# Altium project EDR.PrjPcb
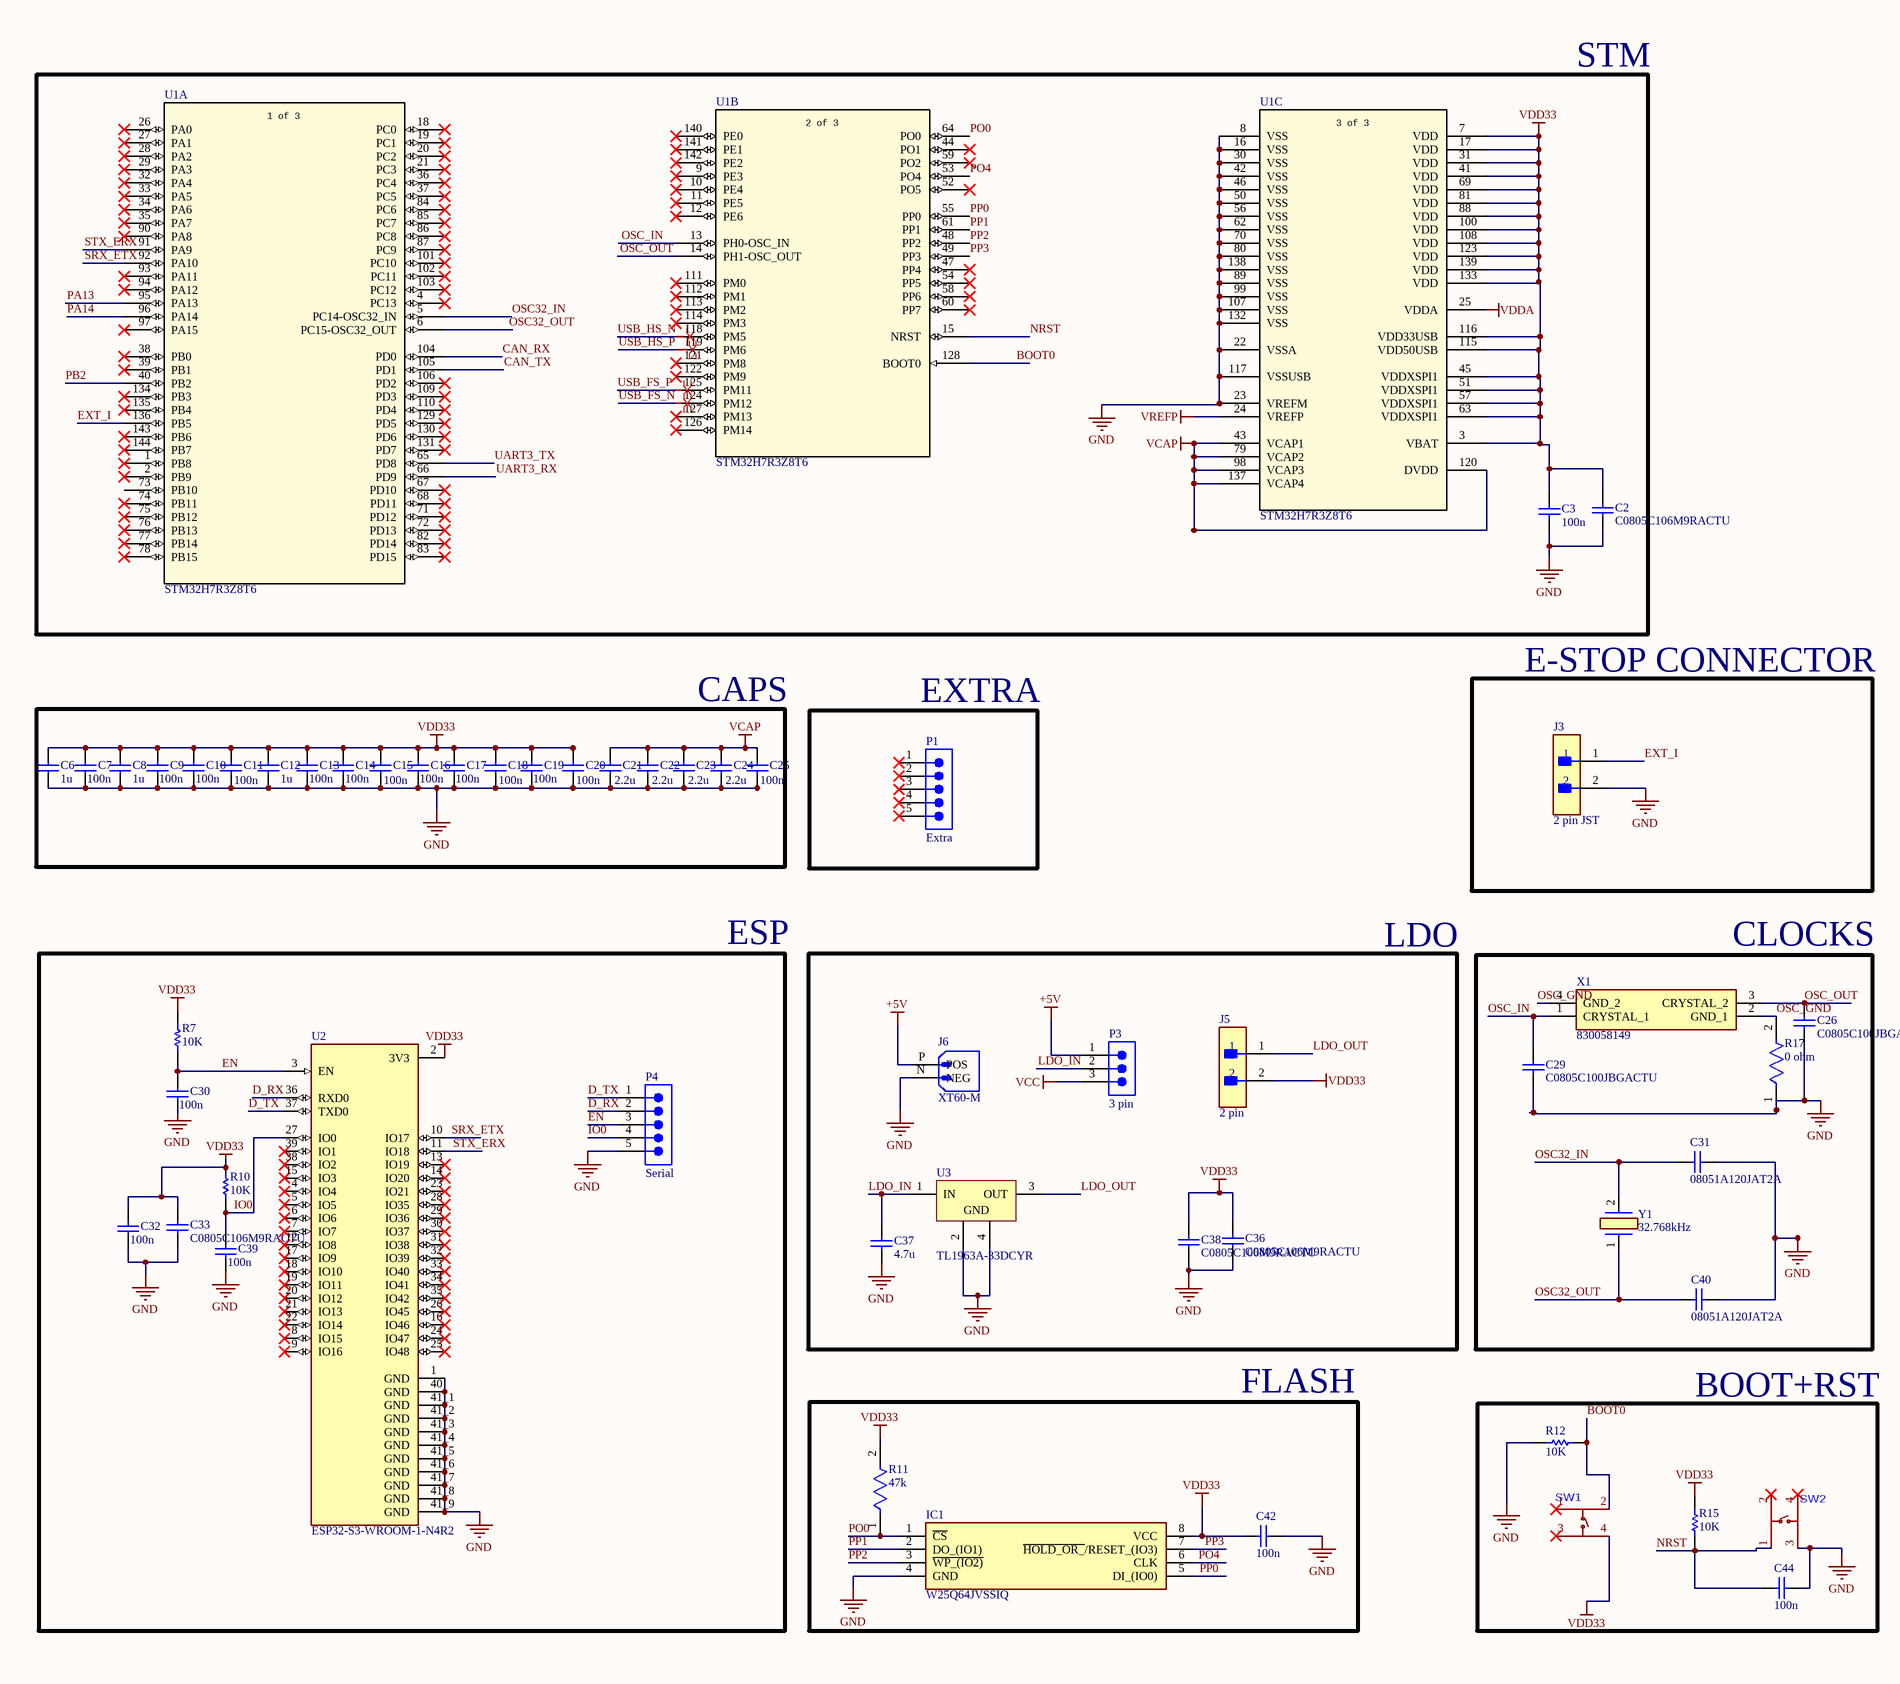
[diagram p0: EDR.SchDoc, left]
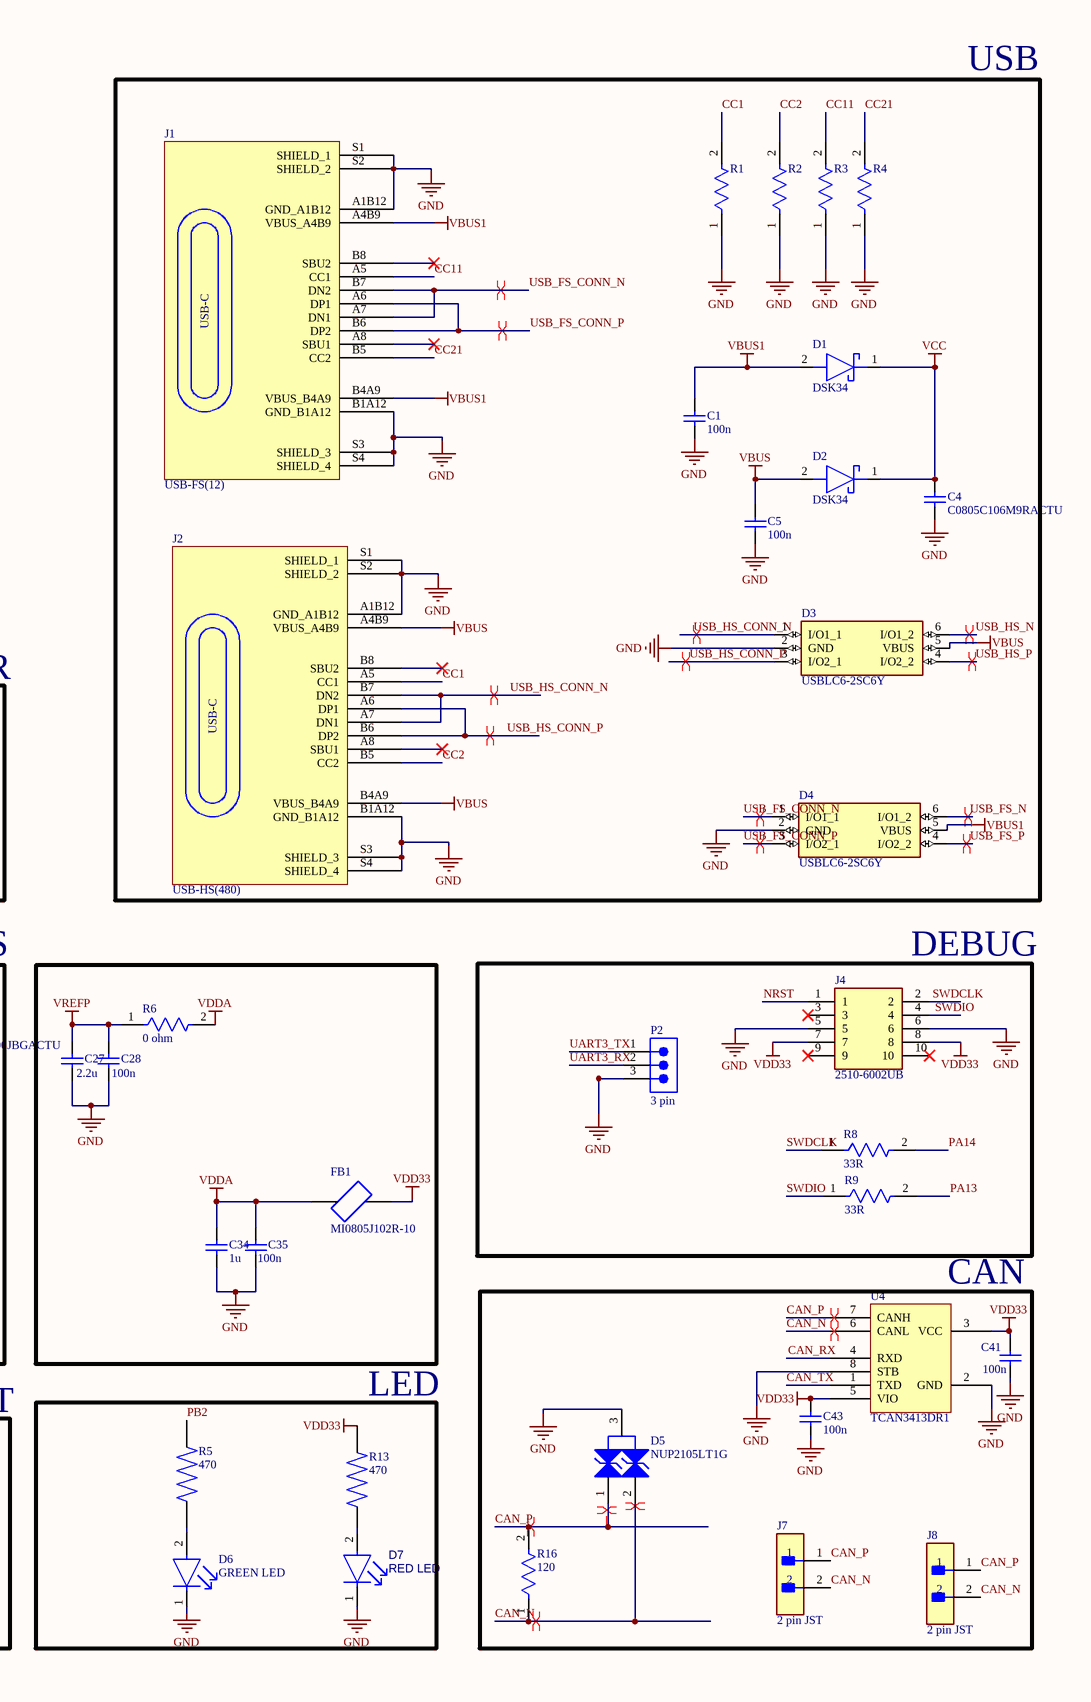
[diagram p1: EDR.SchDoc, right]
1 sheet, 89 parts. Net scope: global (net labels, ports and power ports of the same name join across sheets).
Board file: EDR.PcbDoc

## Sheet EDR.SchDoc: Main Controller
size A2; DrawnBy: Hasith Nettikumara, Chaleesha Keerawella; SheetNumber: 1; SheetTotal: 1

### Parts
C1  100n  [CAPC2013X145X48ML20T23]
C2  C0805C106M9RACTU  [CAPC2013X145X50ML20T25]
C3  100n  [CAPC2013X145X48ML20T23]
C4  C0805C106M9RACTU  [CAPC2013X145X50ML20T25]
C5  100n  [CAPC2013X145X48ML20T23]
C6  1u  [CAPC2013X145X50ML20T20]
C7  100n  [CAPC2013X145X48ML20T23]
C8  1u  [CAPC2013X145X50ML20T20]
C9  100n  [CAPC2013X145X48ML20T23]
C10  100n  [CAPC2013X145X48ML20T23]
C11  100n  [CAPC2013X145X48ML20T23]
C12  1u  [CAPC2013X145X50ML20T20]
C13  100n  [CAPC2013X145X48ML20T23]
C14  100n  [CAPC2013X145X48ML20T23]
C15  100n  [CAPC2013X145X48ML20T23]
C16  100n  [CAPC2013X145X48ML20T23]
C17  100n  [CAPC2013X145X48ML20T23]
C18  100n  [CAPC2013X145X48ML20T23]
C19  100n  [CAPC2013X145X48ML20T23]
C20  100n  [CAPC2013X145X48ML20T23]
C21  2.2u  [CAPC2013X140X50ML20T25]
C22  2.2u  [CAPC2013X140X50ML20T25]
C23  2.2u  [CAPC2013X140X50ML20T25]
C24  2.2u  [CAPC2013X140X50ML20T25]
C25  100n  [CAPC2013X145X48ML20T23]
C26  C0805C100JBGACTU  [CAPC1608X92X38NL15T08]
C27  2.2u  [CAPC2013X140X50ML20T25]
C28  100n  [CAPC2013X145X48ML20T23]
C29  C0805C100JBGACTU  [CAPC1608X92X38NL15T08]
C30  100n  [CAPC2013X145X48ML20T23]
C31  08051A120JAT2A  [CAPC1608X92X38NL15T08]
C32  100n  [CAPC2013X145X48ML20T23]
C33  C0805C106M9RACTU  [CAPC2013X145X50ML20T25]
C34  1u  [CAPC2013X145X50ML20T20]
C35  100n  [CAPC2013X145X48ML20T23]
C36  C0805C106M9RACTU  [CAPC2013X145X50ML20T25]
C37  4.7u  [CAPC2013X145X50ML20T25]
C38  C0805C106M9RACTU  [CAPC2013X145X50ML20T25]
C39  100n  [CAPC2013X145X48ML20T23]
C40  08051A120JAT2A  [CAPC1608X92X38NL15T08]
C41  100n  [CAPC2013X145X48ML20T23]
C42  100n  [CAPC2013X145X48ML20T23]
C43  100n  [CAPC2013X145X48ML20T23]
C44  100n  [CAPC2013X145X48ML20T23]
D1  DSK34  [SODFL3818X130N]
D2  DSK34  [SODFL3818X130N]
D3  USBLC6-2SC6Y  [SOT95P280X145-6N]
D4  USBLC6-2SC6Y  [SOT95P280X145-6N]
D5  NUP2105LT1G  [ONSC-SOT-23-3-318-08_V]
D6  GREEN LED  [FP-SML-210-MFG]
D7  RED LED  [LED_APHCM2012SURCK-F01]
FB1  MI0805J102R-10  [FB_MI0805J102R-10]
IC1  W25Q64JVSSIQ  [SOIC127P790X216-8N]
J1  USB-FS(12)  [FP-2171790001-MFG]
J2  USB-HS(480)  [FP-2171790001-MFG]
J3  2 pin JST  [FP-B2B-XH-A_LF_SN-MFG]
J4  2510-6002UB  [SHDR10W64P254_2X5_2002X859X991P]
J5  2 pin  [FP-TSW-102-07-F-S-MFG]
J6  XT60-M  [AMASS_XT60-M]
J7  2 pin JST  [FP-B2B-XH-A_LF_SN-MFG]
J8  2 pin JST  [FP-B2B-XH-A_LF_SN-MFG]
P1  Extra  [61300511121]
P2  3 pin  [61300311121]
P3  3 pin  [61300311121]
P4  Serial  [61300511121]
R1  (no value)  [FP-AC0805-IPC_B]
R2  (no value)  [FP-AC0805-IPC_B]
R3  (no value)  [FP-AC0805-IPC_B]
R4  (no value)  [FP-AC0805-IPC_B]
R5  470  [RESC2012X65N]
R6  0 ohm  [FP-HCJ0805-IPC_B]
R7  10K  [RESC0805(2012)_M]
R8  33R  [FP-AC0805-IPC_B]
R9  33R  [FP-AC0805-IPC_B]
R10  10K  [RESC0805(2012)_M]
R11  47k  [FP-CRCW0805-e3-IPC_B]
R12  10K  [RESC0805(2012)_M]
R13  470  [RESC2012X65N]
R15  10K  [RESC0805(2012)_M]
R16  120  [FP-RMCF0805-IPC_B]
R17  0 ohm  [FP-HCJ0805-IPC_B]
SW1  4.5X4.5X5.0WATERPROOF TACT SWITCH DIP 260G  [SW-TH_4P-L4.5-W4.5-P3.00-LS5.5 - duplicate]  (value not drawn)
SW2  4.5X4.5X5.0WATERPROOF TACT SWITCH DIP 260G  [SW-TH_4P-L4.5-W4.5-P3.00-LS5.5 - duplicate]  (value not drawn)
U1  STM32H7R3Z8T6  [LQFP-144_STM-M]  (parts A,B,C of 3)
U2  ESP32-S3-WROOM-1-N4R2  [XCVR_ESP32-S3-WROOM-1-N4R2]
U3  TL1963A-33DCYR  [DCY0004A_L]
U4  TCAN3413DR1  [TCAN3413DR1]
X1  830058149  [830058149-x1]
Y1  32.768kHz  [CM7V32768TBQA020]

### Blocks framed on the sheet
STM: C2 C3 U1
USB: C1 C4 C5 D1-D4 J1 J2 R1-R4
CAPS: C6-C25
EXTRA: P1
E-STOP CONNECTOR: J3
ESP: C30 C32 C33 C39 P4 R7 R10 U2
LDO: C36-C38 J5 J6 P3 U3
CLOCKS: C26 C29 C31 C40 R17 X1 Y1
DEBUG: J4 P2 R8 R9
CAN: C41 C43 D5 J7 J8 R16 U4
FLASH: C42 IC1 R11
BOOT+RST: C44 R12 R15 SW1 SW2
LED: D6 D7 R5 R13

### Nets
+5V: J6.P(POS) P3.1
GND: C1.1 C2.1 C3.1 C4.1 C5.1 C6.1 C7.1 C8.1 C9.1 C10.1 C11.1 C12.1 C13.1 C14.1 C15.1 C16.1 C17.1 C18.1 C19.1 C20.1 C21.1 C22.1 C23.1 C24.1 C25.1 C26.2 C27.1 C28.1 C29.1 C30.1 C31.2 C32.1 C33.1 C34.1 C35.1 C36.1 C37.2 C38.1 C39.1 C40.2 C41.1 C42.1 C43.1 C44.1 D3.2(GND) D4.2(GND) D5.3(K) D6.1(C) D7.1(C) IC1.4(GND) J1.A1B12(GND_A1B12) J1.B1A12(GND_B1A12) J1.S1(SHIELD_1) J1.S2(SHIELD_2) J1.S3(SHIELD_3) J1.S4(SHIELD_4) J2.A1B12(GND_A1B12) J2.B1A12(GND_B1A12) J2.S1(SHIELD_1) J2.S2(SHIELD_2) J2.S3(SHIELD_3) J2.S4(SHIELD_4) J3.2 J4.5 J4.6 J6.N(NEG) P2.3 P4.5 R1.1 R2.1 R3.1 R4.1 R12.1 R17.1 SW2.3(C) U1.8(VSS) U1.16(VSS) U1.22(VSSA) U1.23(VREFM) U1.30(VSS) U1.42(VSS) U1.46(VSS) U1.50(VSS) U1.56(VSS) U1.62(VSS) U1.70(VSS) U1.80(VSS) U1.89(VSS) U1.99(VSS) U1.107(VSS) U1.117(VSSUSB) U1.132(VSS) U1.138(VSS) U2.1(GND) U2.40(GND) U2.41_1(GND) U2.41_2(GND) U2.41_3(GND) U2.41_4(GND) U2.41_5(GND) U2.41_6(GND) U2.41_7(GND) U2.41_8(GND) U2.41_9(GND) U3.2(GND) U3.4(GND) U4.2(GND) U4.8(STB)
VBUS: C5.2 D2.2(A) D3.5(VBUS) J2.A4B9(VBUS_A4B9) J2.B4A9(VBUS_B4A9)
VBUS1: C1.2 D1.2(A) D4.5(VBUS) J1.A4B9(VBUS_A4B9) J1.B4A9(VBUS_B4A9)
VCAP: C21.2 C22.2 C23.2 C24.2 C25.2 U1.43(VCAP1) U1.79(VCAP2) U1.98(VCAP3) U1.120(DVDD) U1.137(VCAP4)
VCC: C4.2 D1.1(K) D2.1(K) P3.3
VDD33: C2.2 C3.2 C6.2 C7.2 C8.2 C9.2 C10.2 C11.2 C12.2 C13.2 C14.2 C15.2 C16.2 C17.2 C18.2 C19.2 C20.2 C32.2 C33.2 C36.2 C38.2 C41.2 C42.2 C43.2 FB1.2 IC1.8(VCC) J4.7 J4.8 J5.2 R7.1 R10.1 R11.2 R13.2 R15.2 SW1.4(D) U1.3(VBAT) U1.7(VDD) U1.17(VDD) U1.31(VDD) U1.41(VDD) U1.45(VDDXSPI1) U1.51(VDDXSPI1) U1.57(VDDXSPI1) U1.63(VDDXSPI1) U1.69(VDD) U1.81(VDD) U1.88(VDD) U1.100(VDD) U1.108(VDD) U1.115(VDD50USB) U1.116(VDD33USB) U1.123(VDD) U1.133(VDD) U1.139(VDD) U2.2(3V3) U4.3(VCC) U4.5(VIO)
VDDA: C34.2 C35.2 FB1.1 R6.2 U1.25(VDDA)
VREFP: C27.2 C28.2 R6.1 U1.24(VREFP)
BOOT0: R12.2 SW1.2(B) U1.128(BOOT0)
CAN_N: D5.2(K) J7.2 J8.2 R16.1 U4.6(CANL)
CAN_P: D5.1(K) J7.1 J8.1 R16.2 U4.7(CANH)
CAN_RX: U1.104(PD0) U4.4(RXD)
CAN_TX: U1.105(PD1) U4.1(TXD)
CC1: J2.A5(CC1) R1.2
CC2: J2.B5(CC2) R2.2
CC11: J1.A5(CC1) R3.2
CC21: J1.B5(CC2) R4.2
D_RX: P4.2 U2.36(RXD0)
D_TX: P4.1 U2.37(TXD0)
EN: C30.2 P4.3 R7.2 U2.3(EN)
EXT_I: J3.1 U1.136(PB5)
IO0: C39.2 P4.4 R10.2 U2.27(IO0)
LDO_IN: C37.1 P3.2 U3.1(IN)
LDO_OUT: J5.1 U3.3(OUT)
NRST: C44.2 J4.1 R15.1 SW2.1(A) U1.15(NRST)
OSC32_IN: C31.1 U1.5(PC14-OSC32_IN) Y1.2
OSC32_OUT: C40.1 U1.6(PC15-OSC32_OUT) Y1.1
OSC_GND: R17.2 X1.2(GND_1) X1.4(GND_2)
OSC_IN: C29.2 U1.13(PH0-OSC_IN) X1.1(CRYSTAL_1)
OSC_OUT: C26.1 U1.14(PH1-OSC_OUT) X1.3(CRYSTAL_2)
PA13: R9.2 U1.95(PA13)
PA14: R8.2 U1.96(PA14)
PB2: R5.2 U1.40(PB2)
PO0: IC1.1(~{CS}) R11.1 U1.64(PO0)
PO4: IC1.6(CLK) U1.53(PO4)
PP0: IC1.5(DI_(IO0)) U1.55(PP0)
PP1: IC1.2(DO_(IO1)) U1.61(PP1)
PP2: IC1.3(~{WP_(IO2)}) U1.48(PP2)
PP3: IC1.7(~{HOLD_OR_}/RESET_(IO3)) U1.49(PP3)
SRX_ETX: U1.92(PA10) U2.10(IO17)
STX_ERX: U1.91(PA9) U2.11(IO18)
SWDCLK: J4.2 R8.1
SWDIO: J4.4 R9.1
UART3_RX: P2.2 U1.66(PD9)
UART3_TX: P2.1 U1.65(PD8)
USB_FS_CONN_N: D4.1(I/O1_1) J1.A7(DN1) J1.B7(DN2)
USB_FS_CONN_P: D4.3(I/O2_1) J1.A6(DP1) J1.B6(DP2)
USB_FS_N: D4.6(I/O1_2) U1.124(PM12)
USB_FS_P: D4.4(I/O2_2) U1.125(PM11)
USB_HS_CONN_N: D3.1(I/O1_1) J2.A7(DN1) J2.B7(DN2)
USB_HS_CONN_P: D3.3(I/O2_1) J2.A6(DP1) J2.B6(DP2)
USB_HS_N: D3.6(I/O1_2) U1.118(PM5)
USB_HS_P: D3.4(I/O2_2) U1.119(PM6)
NetD6_2: D6.2(A) R5.1
NetD7_2: D7.2(A) R13.1

Not connected (* = marked no-connect by the designer): J1 A8(SBU1)* B8(SBU2)*; J2 A8(SBU1)* B8(SBU2)*; J4 3* 9* 10*; P1 1* 2* 3* 4* 5*; SW1 1(A)* 3(C)*; SW2 2(B)* 4(D)*; U1 1(PB8)* 2(PB9)* 4(PC13)* 9(PE3)* 10(PE4)* 11(PE5)* 12(PE6)* 18(PC0)* 19(PC1)* 20(PC2)* 21(PC3)* 26(PA0)* 27(PA1)* 28(PA2)* 29(PA3)* 32(PA4)* 33(PA5)* 34(PA6)* 35(PA7)* 36(PC4)* 37(PC5)* 38(PB0)* 39(PB1)* 44(PO1)* 47(PP4)* 52(PO5)* 54(PP5)* 58(PP6)* 59(PO2)* 60(PP7)* 67(PD10)* 68(PD11)* 71(PD12)* 72(PD13)* 73(PB10) 74(PB11)* 75(PB12)* 76(PB13)* 77(PB14)* 78(PB15)* 82(PD14)* 83(PD15)* 84(PC6)* 85(PC7)* 86(PC8)* 87(PC9)* 90(PA8)* 93(PA11)* 94(PA12)* 97(PA15)* 101(PC10)* 102(PC11)* 103(PC12)* 106(PD2)* 109(PD3)* 110(PD4)* 111(PM0)* 112(PM1)* 113(PM2)* 114(PM3)* 121(PM8)* 122(PM9)* 126(PM14)* 127(PM13)* 129(PD5)* 130(PD6)* 131(PD7)* 134(PB3)* 135(PB4)* 140(PE0)* 141(PE1)* 142(PE2)* 143(PB6)* 144(PB7)*; U2 4(IO4)* 5(IO5)* 6(IO6)* 7(IO7)* 8(IO15)* 9(IO16)* 12(IO8)* 13(IO19)* 14(IO20)* 15(IO3)* 16(IO46)* 17(IO9)* 18(IO10)* 19(IO11)* 20(IO12)* 21(IO13)* 22(IO14)* 23(IO21)* 24(IO47)* 25(IO48)* 26(IO45)* 28(IO35)* 29(IO36)* 30(IO37)* 31(IO38)* 32(IO39)* 33(IO40)* 34(IO41)* 35(IO42)* 38(IO2)* 39(IO1)*

### Layout directives
differential pair: CAN_N, CAN_P, USB_FS_CONN_N, USB_FS_CONN_P, USB_FS_N, USB_FS_P, USB_HS_CONN_N, USB_HS_CONN_P, USB_HS_N, USB_HS_P

### Notes on the sheet
- (in symbol 217179-0001) USB-C
- (in symbol STM32H7R3Z8T6, part A) 1 of 3
- (in symbol STM32H7R3Z8T6, part B) 2 of 3
- (in symbol STM32H7R3Z8T6, part C) 3 of 3

### Library data of the parts
C1 C3 C5 C7 C9-C11 C13-C20 C25 C28 C30 C32 C35 C39 C41-C44 = CMP-2007-01796-1: 0.1uF; Part Number: VJ0805Y104MXAMT; Manufacturer: Vitramon; LCSC Part Number: C519981
C2 C4 C33 C36 C38 = CMP-2007-01213-1: 10uF; Manufacturer: Kemet; Part Number: C0805C106M9RACTU; LCSC Part Number: C1710
C6 C8 C12 C34 = CMP-2007-01676-1: 1uF; Part Number: VJ0805Y105KXQRW1BC; Manufacturer: Vitramon; LCSC Part Number: C24123
C21-C24 C27 = CMP-2007-03314-1: 2.2uF; Part Number: C0805X225K8RACTU; Manufacturer: Kemet; LCSC Part Number: C377773
C26 C29 = CMP-2007-03323-1: 10pF; Manufacturer: Kemet; Part Number: C0805C100JBGACTU; LCSC Part Number: C1710
C31 C40 = CMP-2007-04128-1: 7pF; Manufacturer: AVX Interconnect / Elco; Part Number: 08051A120JAT2A; LCSC Part Number: C136031
C37 = CMP-2007-01189-1: 4.7uF; Part Number: C0805C475K9RACTU; Manufacturer: Kemet; LCSC Part Number: C354262
D1 D2 = DSK34: Schottky Diode; Manufacturer_Name: Micro Diode; Datasheet Link: https://atlas.eefcdn.com/partdatasheet/700274/DSK32-THRU-DSK320-SOD-123FL.pdf; Height: 1.3mm; Manufacturer_Part_Number: DSK34; LCSC Part Number: C41371066
D3 D4 = USBLC6-2SC6Y: 17V Clamp 5A (8/20µs) Ipp Tvs Diode Surface Mount SOT-23-6; MF: STMicroelectronics; SnapEDA_Link: https://www.snapeda.com/parts/USBLC6-2SC6Y/STMicroelectronics/view-part/?ref=snap; Package: SOT-23-6 STMicroelectronics; LCSC part #: C2969755; MP: USBLC6-2SC6Y; Check_prices: https://www.snapeda.com/parts/USBLC6-2SC6Y/STMicroelectronics/view-part/?ref=eda; LCSC Part Number: C2969755; Parameter 1: *
D5 = CMP-1063-00164-1: Dual Line CAN Bus Protector, 3-Pin SOT-23, Pb-Free, Tape and Reel; Manufacturer: On Semiconductor; IR Max (uA): 0.1; Number of Lines: 2; Direction: Bidirectional; C Max (pF): 30; PPK Max (W): 350; V(BR) Min (V): 26.2; ComponentLink3URL: http://www.onsemi.cn/pub_link/Collateral/318-08.PDF; Mounting Technology: Surface Mount; ComponentLink2Description: Datasheet; PartNumber: NUP2105LT1G; ComponentLink1URL: http://www.onsemi.com/; PackageVersion: Rev. AP, 11/2009; DatasheetVersion: Rev. 5; RoHS: Pb-Free; PackageReference: SOT-23-3-318-08; ComponentLink2URL: http://www.onsemi.cn/pub_link/Collateral/NUP2105L-D.PDF; ComponentLink1Description: Manufacturer URL; PackageDescription: 3-Pin Small Outline Transistor, Body 2.92 x 1.3 mm, Pitch 0.95 mm; Packing: Tape and Reel; ComponentLink3Description: Package Specification; LCSC Part Number: C14486; LCSC part #: C14486
D6 = CMP-08952-000013-1: LED GREEN CLEAR 0805 SMD; Manufacturer Part Number: SML-210MTT86; Manufacturer: ROHM; Forward Current: 20mA; Reverse Voltage: 4V; Peak Emmision Wavelength: 573nm; Forward Voltage: 2.2V; Luminous Intensity: 16mcd; Power Dissipation: 70mW; Led Orientation: Top View; Wavelength: 570nm; Device Class L2: LEDs; Colour: Green; Height: 0.90mm; Ipc Land Pattern Name: DIOCP200125X25; Automotive: No; Temperature Range High: +85°C; Device Class L3: unset; Temperature: -30°C to +85°C; Device Class L1: Optoelectronics; Mouser Description: Standard LEDs - SMD GREEN SMD TRANS LENS; Temperature Range Low: -30°C; Package: SML-210; Digikey Description: LED GREEN CLEAR 0805 SMD; Lead Free: Yes; ComponentLink2URL: https://www.mouser.in/ds/2/348/sml-21-313092.pdf; ComponentLink2Description: Datasheet; Octopart: https://octopart.com/sml-210mtt86-rohm-550711; RoHS: TRUE; Category: Diode; LCSC Part Number: C84260
D7 = LED_RED_KINGBRIGHT: Forward Current: 20 mA; Voltage - Forward(Vf): 2.5V; LCSC Part Number: C19171391; Manufacturer: KINGBRIGHT
FB1 = MI0805J102R-10: EMI Ferrite Chip Bead, 0805, 1000MA, 1000 Ohms @100MHz, DCR Max 0.150Ohm | Laird Performance Materials MI0805J102R-10; MF: Laird-Signal Integrity Products; SnapEDA_Link: https://www.snapeda.com/parts/MI0805J102R-10/Laird-Signal+Integrity+Products/view-part/?ref=snap; Package: 0805 Laird; Value: *; MP: MI0805J102R-10; Check_prices: https://www.snapeda.com/parts/MI0805J102R-10/Laird-Signal+Integrity+Products/view-part/?ref=eda; LCSC Part Number: C85835
IC1 = W25Q64JVSSIQ: Integrated Circuit; Manufacturer_Name: Winbond; Datasheet Link: https://www.winbond.com/hq/search-resource-file.jsp?partNo=W25Q64JVSSIQ&type=datasheet; Height: 2.16mm; Manufacturer_Part_Number: W25Q64JVSSIQ; Mouser Part Number: 454-W25Q64JVSSIQ; Mouser Price/Stock: https://www.mouser.co.uk/ProductDetail/Winbond/W25Q64JVSSIQ?qs=qSfuJ%252Bfl%2Fd4DecxlHDmB8w%3D%3D; Arrow Part Number: W25Q64JVSSIQ; Arrow Price/Stock: https://www.arrow.com/en/products/w25q64jvssiq/winbond-electronics.html?utm_currency=USD&region=nac; LCSC Part Number: C179171; LCSC part #: C179171
J1 J2 = 217179-0001: CONN RCP USB2.0 TYP C 24P SMD RA; Manufacturer: Molex; Supplier: Digikey; Supplier Part Number: 900-2171790001CT-ND; Manufacturer Part Number: 217179-0001; RoHS: No; Category: Connectors; Stock: 7228; Pricing: 1=0.9, 10=0.745, 100=0.6212 (USD); LCSC Part Number: C3197684; LCSC part #: C3197684
J3 J7 J8 = CMP-2000-05888-3: CONN HEADER VERT 2POS 2.5MM; Current Rating: 3A; Voltage Rating: 250V; Number of Contacts: 2; Contact Resistance: 20mR; Wire/Cable Gauge: 22AWG; Insulation Resistance: 1GR; Connector Type: Male Pin; Packaging: Bulk; Contact Material: Brass; Lead Free: Lead Free; Orientation: Straight; Contact Plating: Tin; Max Current Rating: 3A; Termination: Solder; Fastening Type: Detent; Depth: 5.75mm; Housing Material: Polyamide; REACH SVHC: No SVHC; Series: XH; Voltage Rating (AC): 250V; Number of Positions: 2; Color: Natural; Contact Type: Male Pin; Max Voltage Rating (DC): 250V; Pitch: 2.5mm; Lead Pitch: 2.5mm; Mount: Through Hole; Max Operating Temperature: 85°C; Length: 7.4mm; Max Voltage Rating (AC): 250V; Min Operating Temperature: -25°C; Number of Rows: 1; Housing Color: White; LCSC Part Number: C19271386
J4 = 2510-6002UB: 10 Pin Connector; Manufacturer_Name: 3M; Datasheet Link: http://multimedia.3m.com/mws/media/330367O/3m-four-wall-header-2500-series-ts-0770.pdf; Height: 9.91mm; Manufacturer_Part_Number: 2510-6002UB; Mouser Part Number: 517-2510-6002; Mouser Price/Stock: https://www.mouser.co.uk/ProductDetail/3M-Electronic-Solutions-Division/2510-6002UB?qs=QGTbWukjY6o4fZyiqKm1IQ%3D%3D
J5 = CMP-02766-001458-1: CONN HEADER VERT 2POS 2.54MM; Gender: Male; Max Current Rating: 7.6A; Number of Contacts: 2; Max Voltage Rating (AC): 550V; Orientation: Straight; Depth: 2.54mm; Series: TSW; Package Quantity: 1; Min Operating Temperature: -55°C; Max Operating Temperature: 125°C; Contact Type: Male Pin; Contact Shape: Square; Color: Black; Housing Color: Black; Connector Type: Header; Fastening Type: Pull; Radiation Hardening: No; Pitch: 2.54mm; Housing Material: Polyester; Mount: Through Hole; Number of Positions: 2; Number of Rows: 1; Contact Material: Bronze; Insulation Color: Black; Contact Finish - Mating: GOLD; Termination: Solder; Insulation Material: PBT; Length: 5.08mm; Flammability Rating: UL94 V-0; Contact Mating Length: 0.23inch; REACH SVHC: No SVHC; Contact Plating: Gold; RoHS Compliant: Yes; Packaging: Bulk
J6 = XT60-M: Plug; DC supply; XT60; male; PIN: 2; for cable; soldered; 30A; 500V; MF: AMASS; SnapEDA_Link: https://www.snapeda.com/parts/XT60-M/AMASS/view-part/?ref=snap; Package: Package; Value: *; MP: XT60-M; Check_prices: https://www.snapeda.com/parts/XT60-M/AMASS/view-part/?ref=eda
P1 P4 = CMP-1502-01068-4: THT Vertical Pin Header WR-PHD, Pitch 2.54 mm, Single Row, 5 pins; Number of Contacts: 5; Connector Type: Male Pin; Operating Supply Voltage: 250V; Contact Resistance: 20mΩ; Gender: Male; Pitch: 2.54mm; Current Rating: 3A; Min Operating Temperature: -40°C; Contact Material: Gold; Color: Black; RoHS: Compliant; Number of Rows: 1; Lead Free: Lead Free; Height: 8.89mm; Contact Plating: Gold; Number of Pins: 5; Orientation: Vertical; Voltage Rating: 250V; Packaging: Bulk; Number of Positions: 5; Max Operating Temperature: 105°C; Termination: Solder; Lead Pitch: 2.54mm; Contact Mating Length: 5.9944mm; Mount: Through Hole
P2 P3 = CMP-1502-01062-4: THT Vertical Pin Header WR-PHD, Pitch 2.54 mm, Single Row, 3 pins; Connector Type: Male Pin; Number of Contacts: 3; Operating Supply Voltage: 250V; Current Rating: 3A; Pitch: 2.54mm; Contact Resistance: 20mΩ; Gender: Male; Height: 8.94mm; Color: Black; Min Operating Temperature: -40°C; Max Operating Temperature: 105°C; Mount: Through Hole; Termination: Solder; Number of Rows: 1; Packaging: Bulk; Number of Pins: 3; Lead Pitch: 2.54mm; RoHS: Compliant; Contact Plating: Gold; Number of Positions: 3; Lead Free: Lead Free; Voltage Rating: 250V; Contact Mating Length: 5.9944mm; Orientation: Vertical; Contact Material: Gold
R1-R4 = CMP-2001-04477-2: RES SMD 5.1K OHM 5% 1/2W 0805; Manufacturer: Yageo; Manufacturer Part Number: AC0805JR-075K1L; Automotive Grade: Grade 0; Value: 5.1KΩ; Voltage Rating: 150V; Power Rating: 1/8W; Tolerance: 0.05; Category: Res; RoHS: TRUE; Automotive: Yes; Device Class L1: Passive Components; Lead Free: Yes; Octopart: https://octopart.com/ac0805jr-075k1l-yageo-21711115; Series: AC; Temperature Range High: +155°C; ComponentLink2URL: http://www.yageo.com/documents/recent/PYu-AC_51_RoHS_L_6.pdf; Temperature Range Low: -55°C; ComponentLink2Description: Datasheet; Footprint Url: http://www.yageo.com/exep/pages/download/literatures/PYu-R_Mount_10.pdf; Mouser Description: Thick Film Resistors - SMD 5.1K ohm 5% 1/8W; Device Class L3: Chip SMD Resistors; Digikey Description: RES SMD 5.1K OHM 5% 1/8W 0805; Package: AC0805; Temperature: -55°C to +155°C; Device Class L2: Resistors; Resistance: 5.1KΩ; Height: 0.6mm; Ipc Land Pattern Name: RESC200125X50; Composition: Thick Film; LCSC Part Number: C543469
R5 R13 = CRGCQ0805J470R: Fixed Resistor CRGCQ 0805 470R 5%; MF: TE Connectivity; SnapEDA_Link: https://www.snapeda.com/parts/CRGCQ0805J470R/TE+Connectivity/view-part/?ref=snap; Package: 2012 TE Connectivity; Value: *; MP: CRGCQ0805J470R; Check_prices: https://www.snapeda.com/parts/CRGCQ0805J470R/TE+Connectivity/view-part/?ref=eda; LCSC Part Number: C441978
R6 R17 = CMP-26527-000104-1: RES 0 OHM JUMPER 1/2W 0805; Resistance: 0mR; Radiation Hardening: No; Case Code (Imperial): 0805; Number of Terminations: 2; Lead Free: Lead Free; Max Operating Temperature: 155°C; Width: 0.049inch; Case Code (Metric): 2012; Height: 0.026inch; Mount: Surface Mount; Min Operating Temperature: -55°C; Packaging: Tape and Reel; Package Quantity: 1; Termination: Wraparound; Length: 0.079inch; RoHS Compliant: Yes; Case/Package: 0805
R7 R10 R12 R15 = CMP-1013-00098-1: 10K 0.5W 5% 0805 (2012 Metric)  SMD; Case-EIA: 0805; Case-Metric: 2012; Value: 10000.00 Ohm; Power: 0.5W; Technology: SMT; Tolerance: 5 %; LCSC Part Number: C84376
R8 R9 = CMP-03412-037241-1: RES SMD 33 OHM 1% 1/8W 0805; Manufacturer: Yageo; Manufacturer Part Number: AC0805FR-0733RL; Automotive Grade: Grade 0; Value: 33Ω; Voltage Rating: 150V; Tolerance: 0.01; Octopart: https://octopart.com/ac0805fr-0733rl-yageo-46503501; Device Class L2: Resistors; Temperature: -55°C to +155°C; Composition: Thick Film; ComponentLink2URL: http://www.yageo.com/documents/recent/PYu-AC_51_RoHS_L_6.pdf; Automotive: Yes; Lead Free: Yes; Category: Res; Package: AC0805; Temperature Range Low: -55°C; Device Class L3: Chip SMD Resistors; Temperature Range High: +155°C; Mouser Description: Thick Film Resistors - SMD 1/8W 33ohm 1% AEC-Q200; Footprint Url: http://www.yageo.com/exep/pages/download/literatures/PYu-R_Mount_10.pdf; Resistance: 33Ω; Power Rating: 1/8W; RoHS: TRUE; ComponentLink2Description: Datasheet; Device Class L1: Passive Components; Height: 0.6mm; Series: AC; Digikey Description: RES SMD 33 OHM 1% 1/8W 0805; Ipc Land Pattern Name: RESC200125X50; LCSC part Number: C6234260
R11 = CMP-02407-012789-1: RES Thick Film, 47kΩ, 1%, 0.5W, 100ppm/°C, 0805; Resistance: 47kR; Max Power Dissipation: 500mW; Length: 0.079inch; Number of Terminations: 2; Features: Automotive AEC-Q200; Case/Package: 0805; Temperature Coefficient: 100ppm/°C; Height: 0.02inch; Lead Free: Lead Free; Series: CRCW; Packaging: Tape and Reel; Tolerance: 1%; Resistor Type: Thick Film; Min Operating Temperature: -55°C; Width: 0.049inch; RoHS Compliant: Yes; Max Operating Temperature: 155°C; Depth: 1.25mm; Military Standard: Not; Package Quantity: 20000; LCSC Part Number: C441957
R16 = CMP-26527-002953-1: 120Ω ±5% 0.5W 0805 Thick Film Chip Resistor AEC-Q200 compliant; Temperature Coefficient: 200ppm/°C; Resistance: 120R; Max Power Dissipation: 125mW; Resistor Type: Thick Film; Construction: Rectangular; Packaging: Tape and Reel; Height: 0.026inch; Max Operating Temperature: 155°C; RoHS Compliant: Yes; Tolerance: 5%; Case/Package: 0805; Width: 0.049inch; Radiation Hardening: No; Contact Plating: Tin; Depth: 1.25mm; Number of Terminations: 2; Military Standard: Not; Mount: Surface Mount; Case Code (Imperial): 0805; Length: 0.079inch; Series: RMCF; Case Code (Metric): 2012; Min Operating Temperature: -55°C; Lead Free: Lead Free; Features: Automotive AEC-Q200; LCSC Part Number: C410053
SW1 SW2 = 4.5X4.5X5.0WATERPROOF TACT SWITCH DIP 260G: SMD Switch; LCSC Part Number: C39832249
U1 = STM32H7R3Z8T6: High-Performance Arm Cortex-M7 MCU, 600MHz, 64KB Bootflash, 620KB SRAM, with DSP, cache, USB HS PHY; Manufacturer_Name: STMicroelectronics; Copyright: Copyright (C) 2025 Ultra Librarian. All rights reserved.; Manufacturer_Part_Number: STM32H7R3Z8T6; RefDes: RefDes; Type: Type; LCSC Part Number: C26125147
U2 = ESP32-S3-WROOM-1-N4R2: Bluetooth, WiFi 802.11b/g/n, Bluetooth v5.0 Transceiver Module 2.4GHz PCB Trace Surface Mount; MF: Espressif Systems; Package: None; Purchase-URL: https://pricing.snapeda.com/search/part/ESP32-S3-WROOM-1-N4R2/?ref=eda; Price: None; Availability: In Stock; Check_prices: https://www.snapeda.com/parts/ESP32-S3-WROOM-1-N4R2/Espressif+Systems/view-part/?ref=eda; MP: ESP32-S3-WROOM-1-N4R2; SnapEDA_Link: https://www.snapeda.com/parts/ESP32-S3-WROOM-1-N4R2/Espressif+Systems/view-part/?ref=snap; Value: *; LCSC Part Number: C82899; LCSC part #: C82899
U3 = CMP-0395-00535-2: Single Output Low Noise LDO, 1.5 A, Fixed 3.3 V Output, 2.1 to 20 V Input, 4-pin SOT-223 (DCY), -40 to 125 degC, Green (RoHS & no Sb/Br); Manufacturer: Texas Instruments; Vout Adj(Min)(V): 3.3; Vin(Max)(V): 20; SubFamily: Single Channel LDO; Iq(Typ)(mA): 1; Iout(Max)(A): 1.5; Vin(Min)(V): 2.1; Vdo(Typ)(mV): 340; Accuracy(%): 3; ComponentLink2Description: Datasheet; PackageVersion: 4202506/B; PackageReference: DCY0004A; ComponentLink1Description: Manufacturer URL; Eco-Plan: Green (RoHS & no Sb/Br); ComponentLink1URL: http://www.ti.com/; Fixed Output Options(V): 3.3; ComponentLink2URL: http://www.ti.com/general/docs/lit/getliterature.tsp?genericPartNumber=TL1963A-33&fileType=pdf; Vout Adj(Max)(V): 3.3; PackageDescription: 4-Pin Plastic Small Outline, Body 3.5 x 6.5 mm, Pitch 2.3 mm; ComponentLink3URL: http://www.ti.com/litv/pdf/mpds094a; DatasheetVersion: SLVS719F; PartNumber: TL1963A-33DCYR; Code_JEDEC: TO-261; Mounting Technology: Surface Mount; ComponentLink3Description: Package Specification; LCSC Part Number: C181262; LCSC part #: C181262
U4 = TCAN3413DR1: CAN Transciever; LCSC Part Number: C22396693
X1 = 830058149: WE-XTAL Quartz Crystal CFPX-180; 3.2 x 2.5mm; 24.0 MHz; Tol = +/-10 ppm; Stab = +/-10 ppm Temp Range: -20 to 70 C; Load Cap = 10 pF;; Manufacturer_Name: Wurth Elektronik; Geometry.Height: 0.8mm; Manufacturer_Part_Number: 830058149; Mouser Part Number: 710-830058149; Mouser Price/Stock: https://www.mouser.co.uk/ProductDetail/Wurth-Elektronik/830058149?qs=2WXlatMagcGvGOKbd6jfgQ%3D%3D; Arrow Part Number: *; Arrow Price/Stock: *; Datasheet Link: https://www.we-online.com/catalog/datasheet/830058149.pdf; LCSC part Number: C20617576
Y1 = CM7V-T1A-32.768KHZ-7PF-10PPM-TA-QC: Crystal or Oscillator; Manufacturer_Name: Micro Crystal AG; Datasheet Link: https://www.microcrystal.com/fileadmin/Media/Products/32kHz/Datasheet/CM7V-T1A.pdf; Height: 0.65mm; Manufacturer_Part_Number: CM7V-T1A-32.768KHZ-7PF-10PPM-TA-QC; Mouser Part Number: 428-201563-MG01; Mouser Price/Stock: https://www.mouser.co.uk/ProductDetail/Micro-Crystal/CM7V-T1A-32.768kHz-7pF-10PPM-TA-QC?qs=7bTaA%2FLYtSYKx%2FblBI5vsQ%3D%3D; Arrow Part Number: CM7V-T1A-32.768KHZ-7PF-10PPM-TA-QC; Arrow Price/Stock: https://www.arrow.com/en/products/cm7v-t1a-32.768khz-7pf-10ppm-ta-qc/micro-crystal-ag?region=nac; LCSC part Number: C5366534